# Altium schematic sheet STEPPER.SchDoc
size A
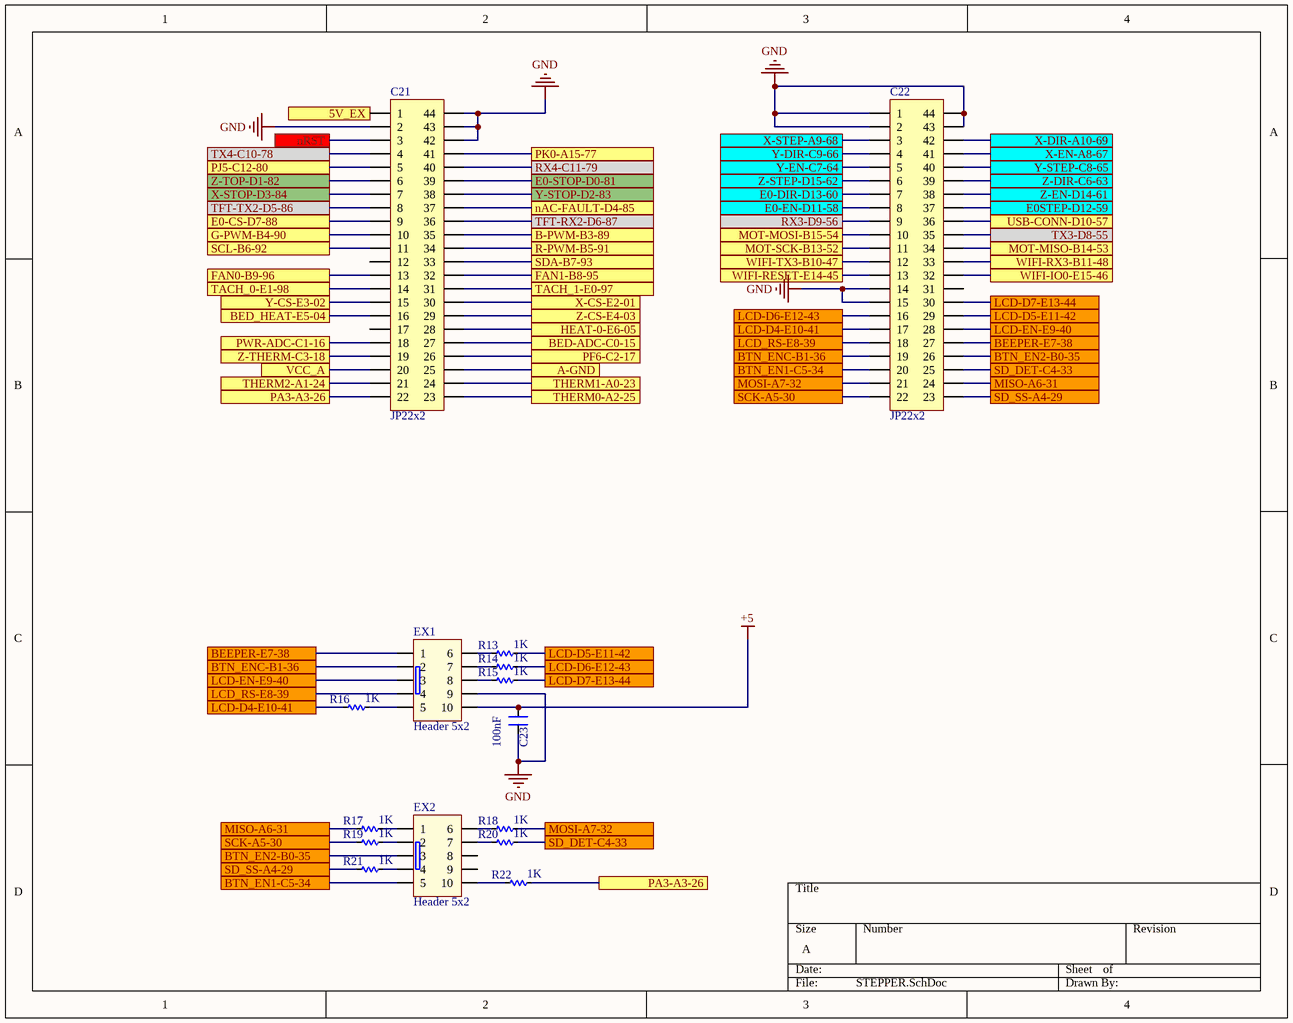
[diagram p0: STEPPER.SchDoc]

## Parts
C21  JP22x2  [JP22-C2T]
C22  JP22x2  [JP22-C2T]
C23  100nF  [CN-SMD-0603_big]
EX1  Header 5x2  [Hed2X5]
EX2  Header 5x2  [Hed2X5]
R13  1K  [RES-SMD-0603_BIG]
R14  1K  [RES-SMD-0603_BIG]
R15  1K  [RES-SMD-0603_BIG]
R16  1K  [RES-SMD-0603_BIG]
R17  1K  [RES-SMD-0603_BIG]
R18  1K  [RES-SMD-0603_BIG]
R19  1K  [RES-SMD-0603_BIG]
R20  1K  [RES-SMD-0603_BIG]
R21  1K  [RES-SMD-0603_BIG]
R22  1K  [RES-SMD-0603_BIG]

## Ports
5V_EX, A-GND, B-PWM-B3-89, BED-ADC-C0-15, BED_HEAT-E5-04, BEEPER-E7-38, BTN_EN1-C5-34, BTN_EN2-B0-35, BTN_ENC-B1-36, E0-CS-D7-88, E0-DIR-D13-60, E0-EN-D11-58, E0-STOP-D0-81, E0STEP-D12-59, FAN0-B9-96, FAN1-B8-95, G-PWM-B4-90, HEAT-0-E6-05, LCD-D4-E10-41, LCD-D5-E11-42, LCD-D6-E12-43, LCD-D7-E13-44, LCD-EN-E9-40, LCD_RS-E8-39, MISO-A6-31, MOSI-A7-32, MOT-MISO-B14-53, MOT-MOSI-B15-54, MOT-SCK-B13-52, nAC-FAULT-D4-85, nRST, PA3-A3-26, PF6-C2-17, PJ5-C12-80, PK0-A15-77, PWR-ADC-C1-16, R-PWM-B5-91, RX3-D9-56, RX4-C11-79, SCK-A5-30, SCL-B6-92, SD_DET-C4-33, SD_SS-A4-29, SDA-B7-93, TACH_0-E1-98, TACH_1-E0-97, TFT-RX2-D6-87, TFT-TX2-D5-86, THERM0-A2-25, THERM1-A0-23, THERM2-A1-24, TX3-D8-55, TX4-C10-78, USB-CONN-D10-57, VCC_A, WIFI-IO0-E15-46, WIFI-RESET-E14-45, WIFI-RX3-B11-48, WIFI-TX3-B10-47, X-CS-E2-01, X-DIR-A10-69, X-EN-A8-67, X-STEP-A9-68, X-STOP-D3-84, Y-CS-E3-02, Y-DIR-C9-66, Y-EN-C7-64, Y-STEP-C8-65, Y-STOP-D2-83, Z-CS-E4-03, Z-DIR-C6-63, Z-EN-D14-61, Z-STEP-D15-62, Z-THERM-C3-18, Z-TOP-D1-82

## Nets
+5: C23.2 EX1.10
GND: C21.2 C21.42 C21.43 C21.44 C22.1 C22.2 C22.14 C22.15 C22.43 C22.44 C23.1 EX1.9
5V_EX: C21.1 ; port 5V_EX
A-GND: C21.25 ; port A-GND
B-PWM-B3-89: C21.35 ; port B-PWM-B3-89
BED-ADC-C0-15: C21.27 ; port BED-ADC-C0-15
BED_HEAT-E5-04: C21.16 ; port BED_HEAT-E5-04
BEEPER-E7-38: C22.27 EX1.1 ; port BEEPER-E7-38
BTN_EN1-C5-34: C22.20 EX2.5 ; port BTN_EN1-C5-34
BTN_EN2-B0-35: C22.26 EX2.3 ; port BTN_EN2-B0-35
BTN_ENC-B1-36: C22.19 EX1.2 ; port BTN_ENC-B1-36
E0-CS-D7-88: C21.9 ; port E0-CS-D7-88
E0-DIR-D13-60: C22.7 ; port E0-DIR-D13-60
E0-EN-D11-58: C22.8 ; port E0-EN-D11-58
E0-STOP-D0-81: C21.39 ; port E0-STOP-D0-81
E0STEP-D12-59: C22.37 ; port E0STEP-D12-59
FAN0-B9-96: C21.13 ; port FAN0-B9-96
FAN1-B8-95: C21.32 ; port FAN1-B8-95
G-PWM-B4-90: C21.10 ; port G-PWM-B4-90
HEAT-0-E6-05: C21.28 ; port HEAT-0-E6-05
LCD-D4-E10-41: C22.17 R16.2 ; port LCD-D4-E10-41
LCD-D5-E11-42: C22.29 R13.1 ; port LCD-D5-E11-42
LCD-D6-E12-43: C22.16 R14.1 ; port LCD-D6-E12-43
LCD-D7-E13-44: C22.30 R15.1 ; port LCD-D7-E13-44
LCD-EN-E9-40: C22.28 EX1.3 ; port LCD-EN-E9-40
LCD_RS-E8-39: C22.18 EX1.4 ; port LCD_RS-E8-39
MISO-A6-31: C22.24 R17.2 ; port MISO-A6-31
MOSI-A7-32: C22.21 R18.1 ; port MOSI-A7-32
MOT-MISO-B14-53: C22.34 ; port MOT-MISO-B14-53
MOT-MOSI-B15-54: C22.10 ; port MOT-MOSI-B15-54
MOT-SCK-B13-52: C22.11 ; port MOT-SCK-B13-52
nAC-FAULT-D4-85: C21.37 ; port nAC-FAULT-D4-85
nRST: C21.3 ; port nRST
PA3-A3-26: C21.22 R22.1 ; port PA3-A3-26
PF6-C2-17: C21.26 ; port PF6-C2-17
PJ5-C12-80: C21.5 ; port PJ5-C12-80
PK0-A15-77: C21.41 ; port PK0-A15-77
PWR-ADC-C1-16: C21.18 ; port PWR-ADC-C1-16
R-PWM-B5-91: C21.34 ; port R-PWM-B5-91
RX3-D9-56: C22.9 ; port RX3-D9-56
RX4-C11-79: C21.40 ; port RX4-C11-79
SCK-A5-30: C22.22 R19.2 ; port SCK-A5-30
SCL-B6-92: C21.11 ; port SCL-B6-92
SD_DET-C4-33: C22.25 R20.1 ; port SD_DET-C4-33
SD_SS-A4-29: C22.23 R21.2 ; port SD_SS-A4-29
SDA-B7-93: C21.33 ; port SDA-B7-93
TACH_0-E1-98: C21.14 ; port TACH_0-E1-98
TACH_1-E0-97: C21.31 ; port TACH_1-E0-97
TFT-RX2-D6-87: C21.36 ; port TFT-RX2-D6-87
TFT-TX2-D5-86: C21.8 ; port TFT-TX2-D5-86
THERM0-A2-25: C21.23 ; port THERM0-A2-25
THERM1-A0-23: C21.24 ; port THERM1-A0-23
THERM2-A1-24: C21.21 ; port THERM2-A1-24
TX3-D8-55: C22.35 ; port TX3-D8-55
TX4-C10-78: C21.4 ; port TX4-C10-78
USB-CONN-D10-57: C22.36 ; port USB-CONN-D10-57
VCC_A: C21.20 ; port VCC_A
WIFI-IO0-E15-46: C22.32 ; port WIFI-IO0-E15-46
WIFI-RESET-E14-45: C22.13 ; port WIFI-RESET-E14-45
WIFI-RX3-B11-48: C22.33 ; port WIFI-RX3-B11-48
WIFI-TX3-B10-47: C22.12 ; port WIFI-TX3-B10-47
X-CS-E2-01: C21.30 ; port X-CS-E2-01
X-DIR-A10-69: C22.42 ; port X-DIR-A10-69
X-EN-A8-67: C22.41 ; port X-EN-A8-67
X-STEP-A9-68: C22.3 ; port X-STEP-A9-68
X-STOP-D3-84: C21.7 ; port X-STOP-D3-84
Y-CS-E3-02: C21.15 ; port Y-CS-E3-02
Y-DIR-C9-66: C22.4 ; port Y-DIR-C9-66
Y-EN-C7-64: C22.5 ; port Y-EN-C7-64
Y-STEP-C8-65: C22.40 ; port Y-STEP-C8-65
Y-STOP-D2-83: C21.38 ; port Y-STOP-D2-83
Z-CS-E4-03: C21.29 ; port Z-CS-E4-03
Z-DIR-C6-63: C22.39 ; port Z-DIR-C6-63
Z-EN-D14-61: C22.38 ; port Z-EN-D14-61
Z-STEP-D15-62: C22.6 ; port Z-STEP-D15-62
Z-THERM-C3-18: C21.19 ; port Z-THERM-C3-18
Z-TOP-D1-82: C21.6 ; port Z-TOP-D1-82
NetEX1_5: EX1.5 R16.1
NetEX1_6: EX1.6 R13.2
NetEX1_7: EX1.7 R14.2
NetEX1_8: EX1.8 R15.2
NetEX2_1: EX2.1 R17.1
NetEX2_2: EX2.2 R19.1
NetEX2_4: EX2.4 R21.1
NetEX2_6: EX2.6 R18.2
NetEX2_7: EX2.7 R20.2
NetEX2_10: EX2.10 R22.2

Not connected (* = marked no-connect by the designer): C21 12 17; C22 31; EX2 8 9

## Library data of the parts
C21 C22 = JP22x2: WR-PHD 2.54 mm Dual Socket Header; Manufacturer: W¨¹rth Elektronik eiSos GmbH; partNo: 61304421821; ComponentLink1 Description: Manufacturer; ComponentLink2 Description: Datasheet; NoPins: 44; Created Date: 29 March 2013; ComponentLink1URL: http://www.we-online.com; ComponentLink2URL: http://katalog.we-online.de/em/datasheet/6130xx21821.pdf; Created by: Karrer Zheng
C23 = CN: Value: 33pF
EX1 EX2 = HED5x2: Value: Header 5x2
R13-R22 = R